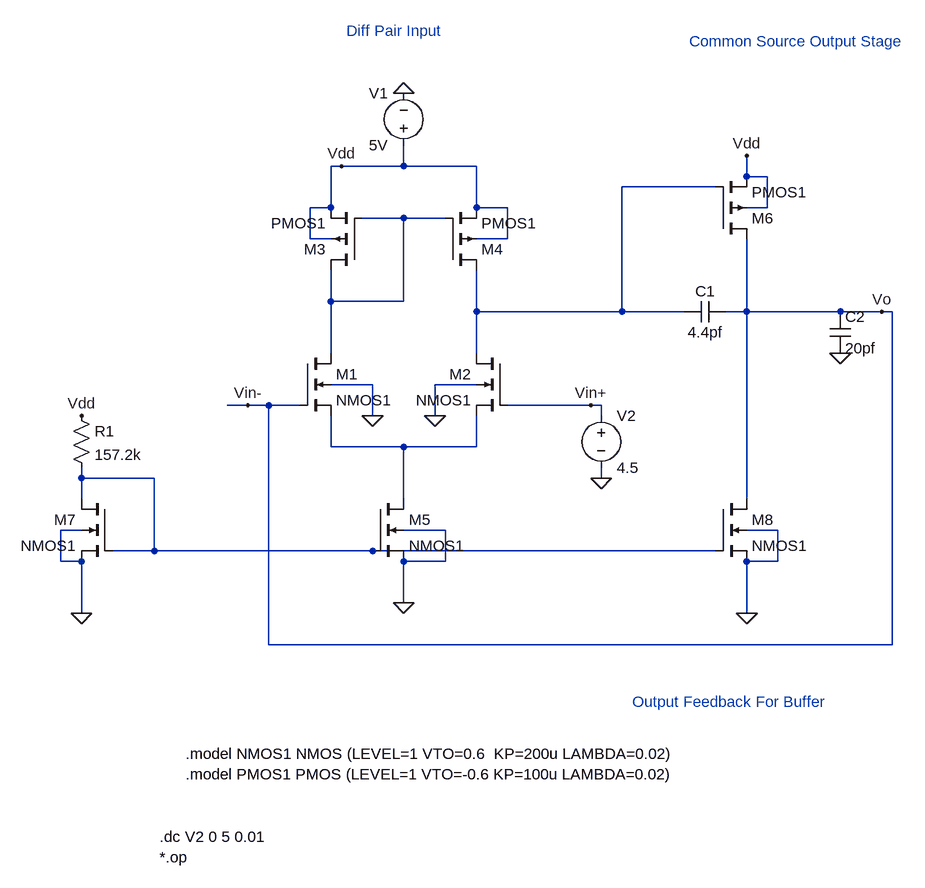
[diagram p0: schematic MOSFET_Op_amp.asc]
MOSFET_Op_amp.asc, the LTspice schematic file:
Version 4.1
SHEET 1 1032 1476
WIRE 144 -16 128 -16
WIRE 240 -16 240 -48
WIRE 240 -16 144 -16
WIRE 352 -16 240 -16
WIRE 768 0 768 -32
WIRE 800 0 768 0
WIRE 720 16 576 16
WIRE 128 48 128 -16
WIRE 128 48 96 48
WIRE 352 48 352 -16
WIRE 400 48 352 48
WIRE 800 48 800 0
WIRE 800 48 768 48
WIRE 240 64 176 64
WIRE 304 64 240 64
WIRE 96 96 96 48
WIRE 128 96 96 96
WIRE 400 96 400 48
WIRE 400 96 352 96
WIRE 128 192 128 144
WIRE 240 192 240 64
WIRE 240 192 128 192
WIRE 352 208 352 144
WIRE 576 208 576 16
WIRE 576 208 352 208
WIRE 672 208 576 208
WIRE 768 208 768 96
WIRE 768 208 736 208
WIRE 912 208 768 208
WIRE 976 208 912 208
WIRE 992 208 976 208
WIRE 128 272 128 192
WIRE 352 272 352 208
WIRE 192 320 128 320
WIRE 352 320 288 320
WIRE 0 352 -32 352
WIRE 32 352 0 352
WIRE 80 352 32 352
WIRE 528 352 400 352
WIRE 544 352 528 352
WIRE 192 368 192 320
WIRE 288 368 288 320
WIRE 544 368 544 352
WIRE 128 416 128 368
WIRE 240 416 128 416
WIRE 352 416 352 368
WIRE 352 416 240 416
WIRE -256 464 -256 448
WIRE -144 464 -256 464
WIRE 544 464 544 448
WIRE -256 496 -256 464
WIRE 240 496 240 416
WIRE 768 496 768 208
WIRE -256 544 -288 544
WIRE 304 544 240 544
WIRE 816 544 768 544
WIRE -144 576 -144 464
WIRE -144 576 -208 576
WIRE 192 576 -144 576
WIRE 720 576 192 576
WIRE -288 592 -288 544
WIRE -256 592 -288 592
WIRE 304 592 304 544
WIRE 304 592 240 592
WIRE 816 592 816 544
WIRE 816 592 768 592
WIRE 240 656 240 592
WIRE -256 672 -256 592
WIRE 768 672 768 592
WIRE 32 720 32 352
WIRE 992 720 992 208
WIRE 992 720 32 720
FLAG 240 656 0
FLAG 240 -128 0
FLAG 192 368 0
FLAG 288 368 0
FLAG 768 -32 Vdd
FLAG 976 208 Vo
FLAG 544 464 0
FLAG 912 272 0
FLAG 144 -16 Vdd
FLAG 528 352 Vin+
FLAG 0 352 Vin-
FLAG -256 672 0
FLAG -256 368 Vdd
FLAG 768 672 0
SYMBOL nmos4 80 272 R0
SYMATTR InstName M1
SYMATTR Value NMOS1
SYMATTR Value2 l=300n w=300n
SYMBOL nmos4 400 272 M0
SYMATTR InstName M2
SYMATTR Value NMOS1
SYMATTR Value2 l=300n w=300n
SYMBOL voltage 240 -32 R180
WINDOW 0 24 96 Left 2
WINDOW 3 24 16 Left 2
WINDOW 123 0 0 Left 0
WINDOW 39 0 0 Left 0
SYMATTR InstName V1
SYMATTR Value 5V
SYMBOL voltage 544 352 R0
WINDOW 123 0 0 Left 0
WINDOW 39 0 0 Left 0
SYMATTR InstName V2
SYMATTR Value 4.5
SYMBOL cap 736 192 R90
WINDOW 0 0 32 VBottom 2
WINDOW 3 32 32 VTop 2
SYMATTR InstName C1
SYMATTR Value 4.4pf
SYMBOL pmos4 176 144 R180
SYMATTR InstName M3
SYMATTR Value PMOS1
SYMATTR Value2 l=300n w=600n
SYMBOL pmos4 304 144 M180
SYMATTR InstName M4
SYMATTR Value PMOS1
SYMATTR Value2 l=300n w=600n
SYMBOL pmos4 720 96 M180
SYMATTR InstName M6
SYMATTR Value PMOS1
SYMATTR Value2 l=300n w=3300n
SYMBOL cap 896 208 R0
SYMATTR InstName C2
SYMATTR Value 20pf
SYMBOL nmos4 192 496 R0
SYMATTR InstName M5
SYMATTR Value NMOS1
SYMATTR Value2 l=300n w=3900n
SYMBOL nmos4 -208 496 M0
SYMATTR InstName M7
SYMATTR Value NMOS1
SYMATTR Value2 l=300n w=3900n
SYMBOL res -272 352 R0
SYMATTR InstName R1
SYMATTR Value 157.2k
SYMBOL nmos4 720 496 R0
SYMATTR InstName M8
SYMATTR Value NMOS1
SYMATTR Value2 l=300n w=11000n
TEXT -136 1016 Left 2 !.dc V2 0 5 0.01\n*.op
TEXT 592 808 Left 2 ;Output Feedback For Buffer
TEXT -96 888 Left 2 !.model NMOS1 NMOS (LEVEL=1 VTO=0.6  KP=200u LAMBDA=0.02)\n.model PMOS1 PMOS (LEVEL=1 VTO=-0.6 KP=100u LAMBDA=0.02)
TEXT 152 -224 Left 2 ;Diff Pair Input
TEXT 680 -208 Left 2 ;Common Source Output Stage

The netlist it stands for:
* MOSFET_Op_amp.asc
M1 N002 Vin- N003 0 NMOS1 l=300n w=300n
M2 N001 Vin+ N003 0 NMOS1 l=300n w=300n
V1 Vdd 0 5V
V2 Vin+ 0 4.5
C1 Vin- N001 4.4pf
M3 N002 N002 Vdd Vdd PMOS1 l=300n w=600n
M4 N001 N002 Vdd Vdd PMOS1 l=300n w=600n
M6 Vin- N001 Vdd Vdd PMOS1 l=300n w=3300n
C2 Vin- 0 20pf
M5 N003 N004 0 0 NMOS1 l=300n w=3900n
M7 N004 N004 0 0 NMOS1 l=300n w=3900n
R1 Vdd N004 157.2k
M8 Vin- N004 0 0 NMOS1 l=300n w=11000n
.model NMOS NMOS
.model PMOS PMOS
.lib standard.mos
.dc V2 0 5 0.01
*.op
* Output Feedback For Buffer
.model NMOS1 NMOS (LEVEL=1 VTO=0.6  KP=200u LAMBDA=0.02)
.model PMOS1 PMOS (LEVEL=1 VTO=-0.6 KP=100u LAMBDA=0.02)
* Diff Pair Input
* Common Source Output Stage
.backanno
.end

* Results of the author's LTspice run, read from the files saved beside the schematic
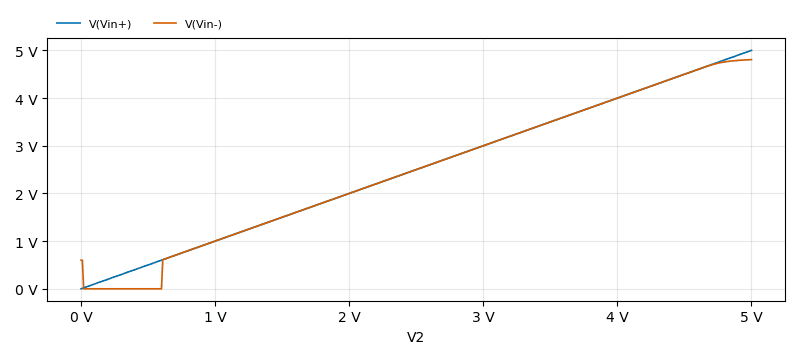
[diagram p1: DC transfer characteristic of MOSFET_Op_amp.asc, plotted from the saved traces]
* DC transfer characteristic, 1 run:
*   V(Vin+): 0 V at V2=0 V, 5 V at V2=5 V, min 0 V, max 5 V
*   V(Vin-): 600.4 mV at V2=0 V, 4.806 V at V2=5 V, min -110.2 nV, max 4.806 V